# EAGLE schematic PCB - BOARD (EAGLE 8.2.0)

## Sheet 1 of 9
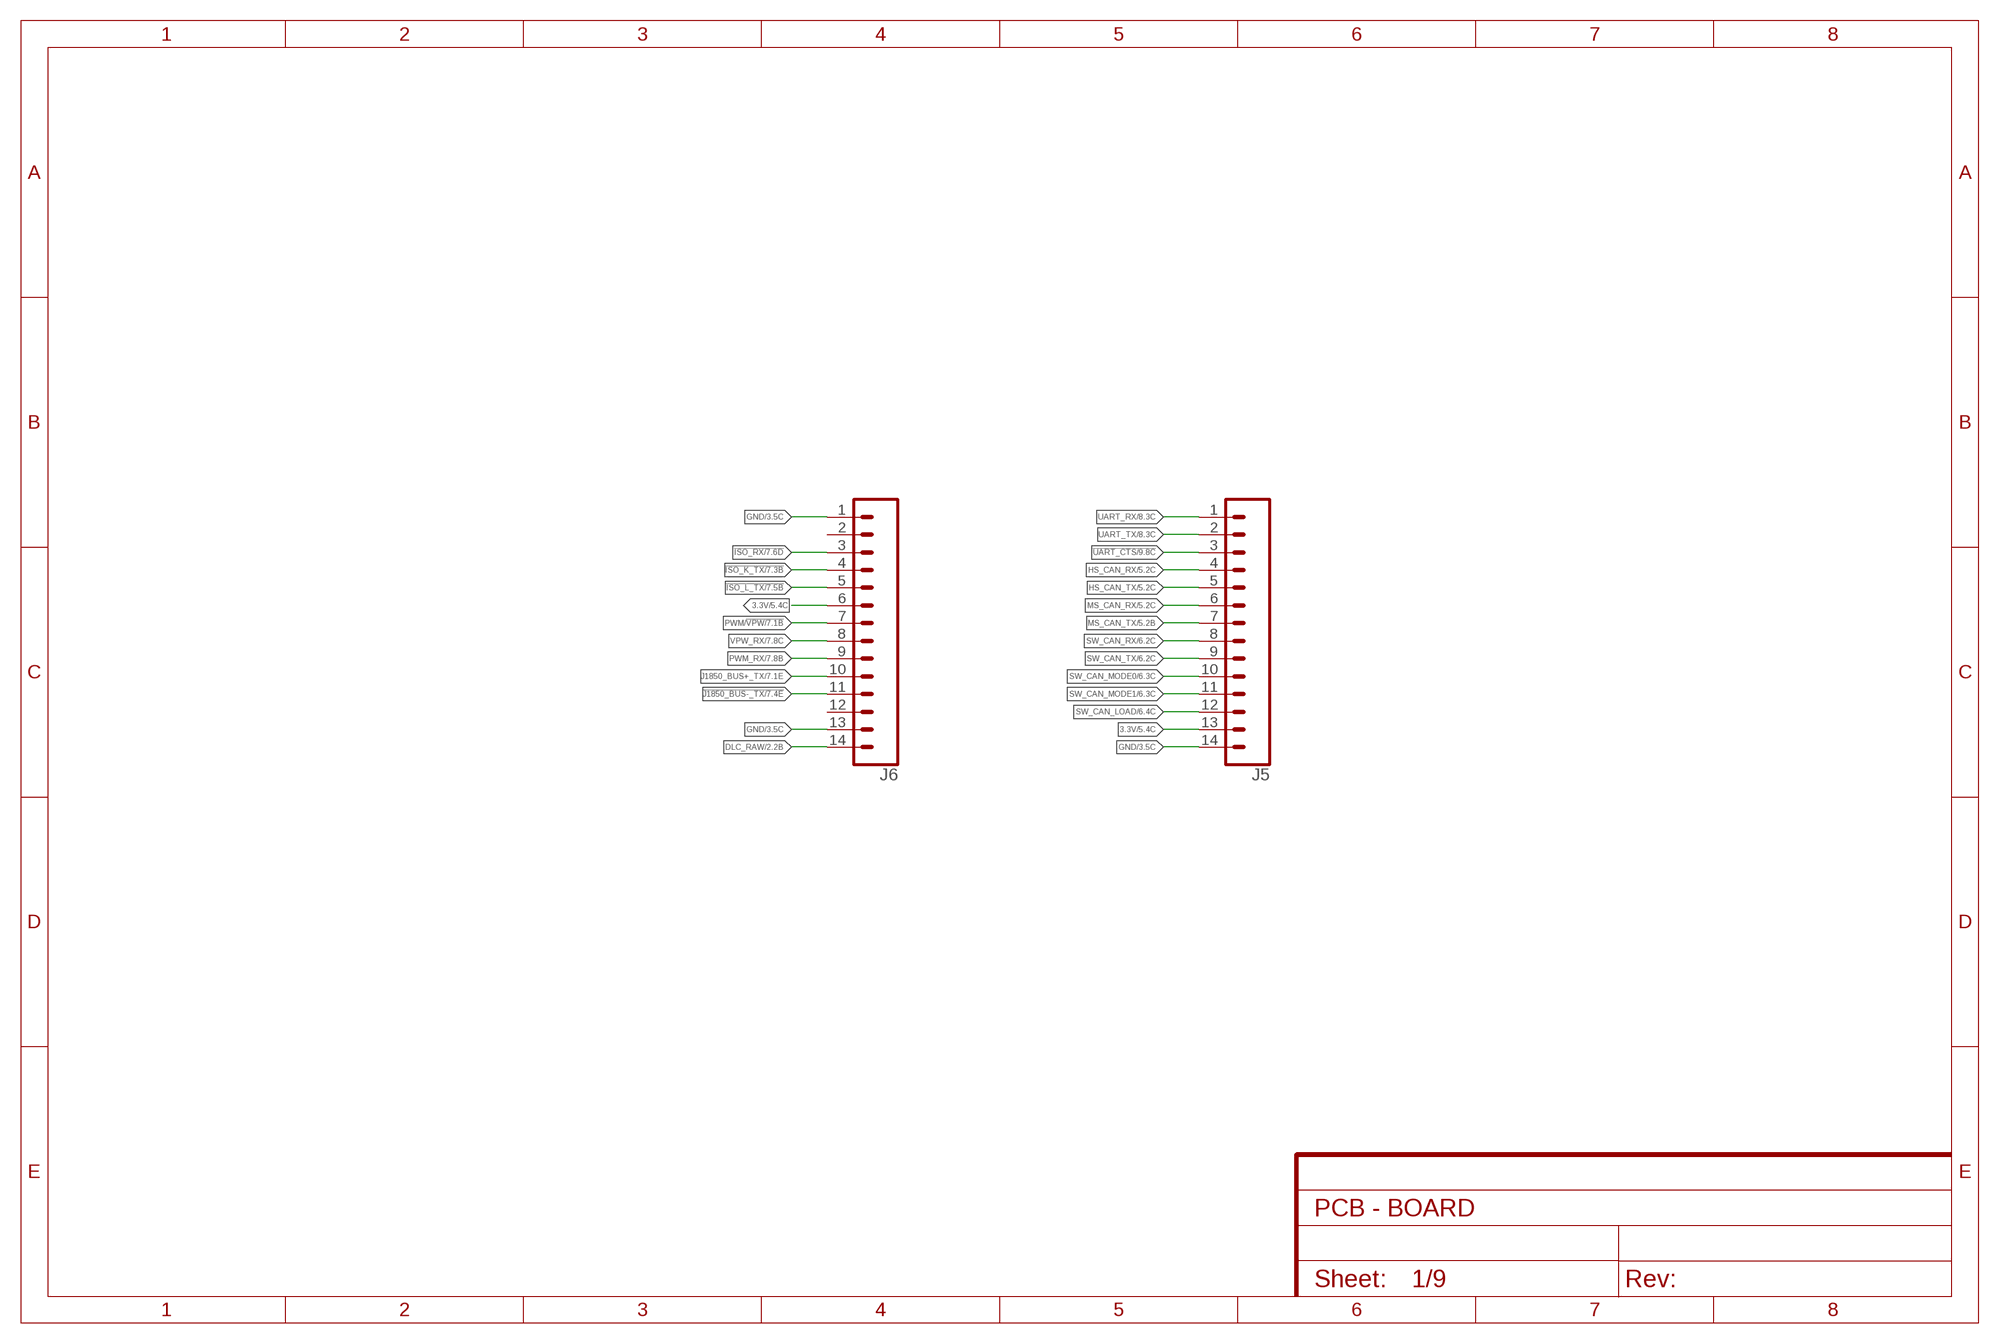
[diagram p0: schematic, sheet 1]

### Parts
J5  CONN_14  [1X14]
J6  CONN_14  [1X14]

### Nets
3.3V: J5.13 J6.6 ; also sheet 2,4,5,6,7,8
!ISO_K_TX: J6.4 ; also sheet 7
!ISO_L_TX: J6.5 ; also sheet 7
!ISO_RX: J6.3 ; also sheet 7
!J1850_BUS-_TX: J6.11 ; also sheet 7
!UART_CTS: J5.3 ; also sheet 9
DLC_RAW: J6.14 ; also sheet 2,3
GND: J5.14 J6.1 J6.13 ; also sheet 2,3,4,5,6,7,8,9
HS_CAN_RX: J5.4 ; also sheet 5
HS_CAN_TX: J5.5 ; also sheet 5
J1850_BUS+_TX: J6.10 ; also sheet 7
MS_CAN_RX: J5.6 ; also sheet 5
MS_CAN_TX: J5.7 ; also sheet 5
PWM/!VPW: J6.7 ; also sheet 7
PWM_RX: J6.9 ; also sheet 7
SW_CAN_LOAD: J5.12 ; also sheet 6
SW_CAN_MODE0: J5.10 ; also sheet 6
SW_CAN_MODE1: J5.11 ; also sheet 6
SW_CAN_RX: J5.8 ; also sheet 6
SW_CAN_TX: J5.9 ; also sheet 6
UART_RX: J5.1 ; also sheet 8,9
UART_TX: J5.2 ; also sheet 8,9
VPW_RX: J6.8 ; also sheet 7
Unconnected: J6.2 J6.12

## Sheet 2 of 9: POWER SUPPLIES
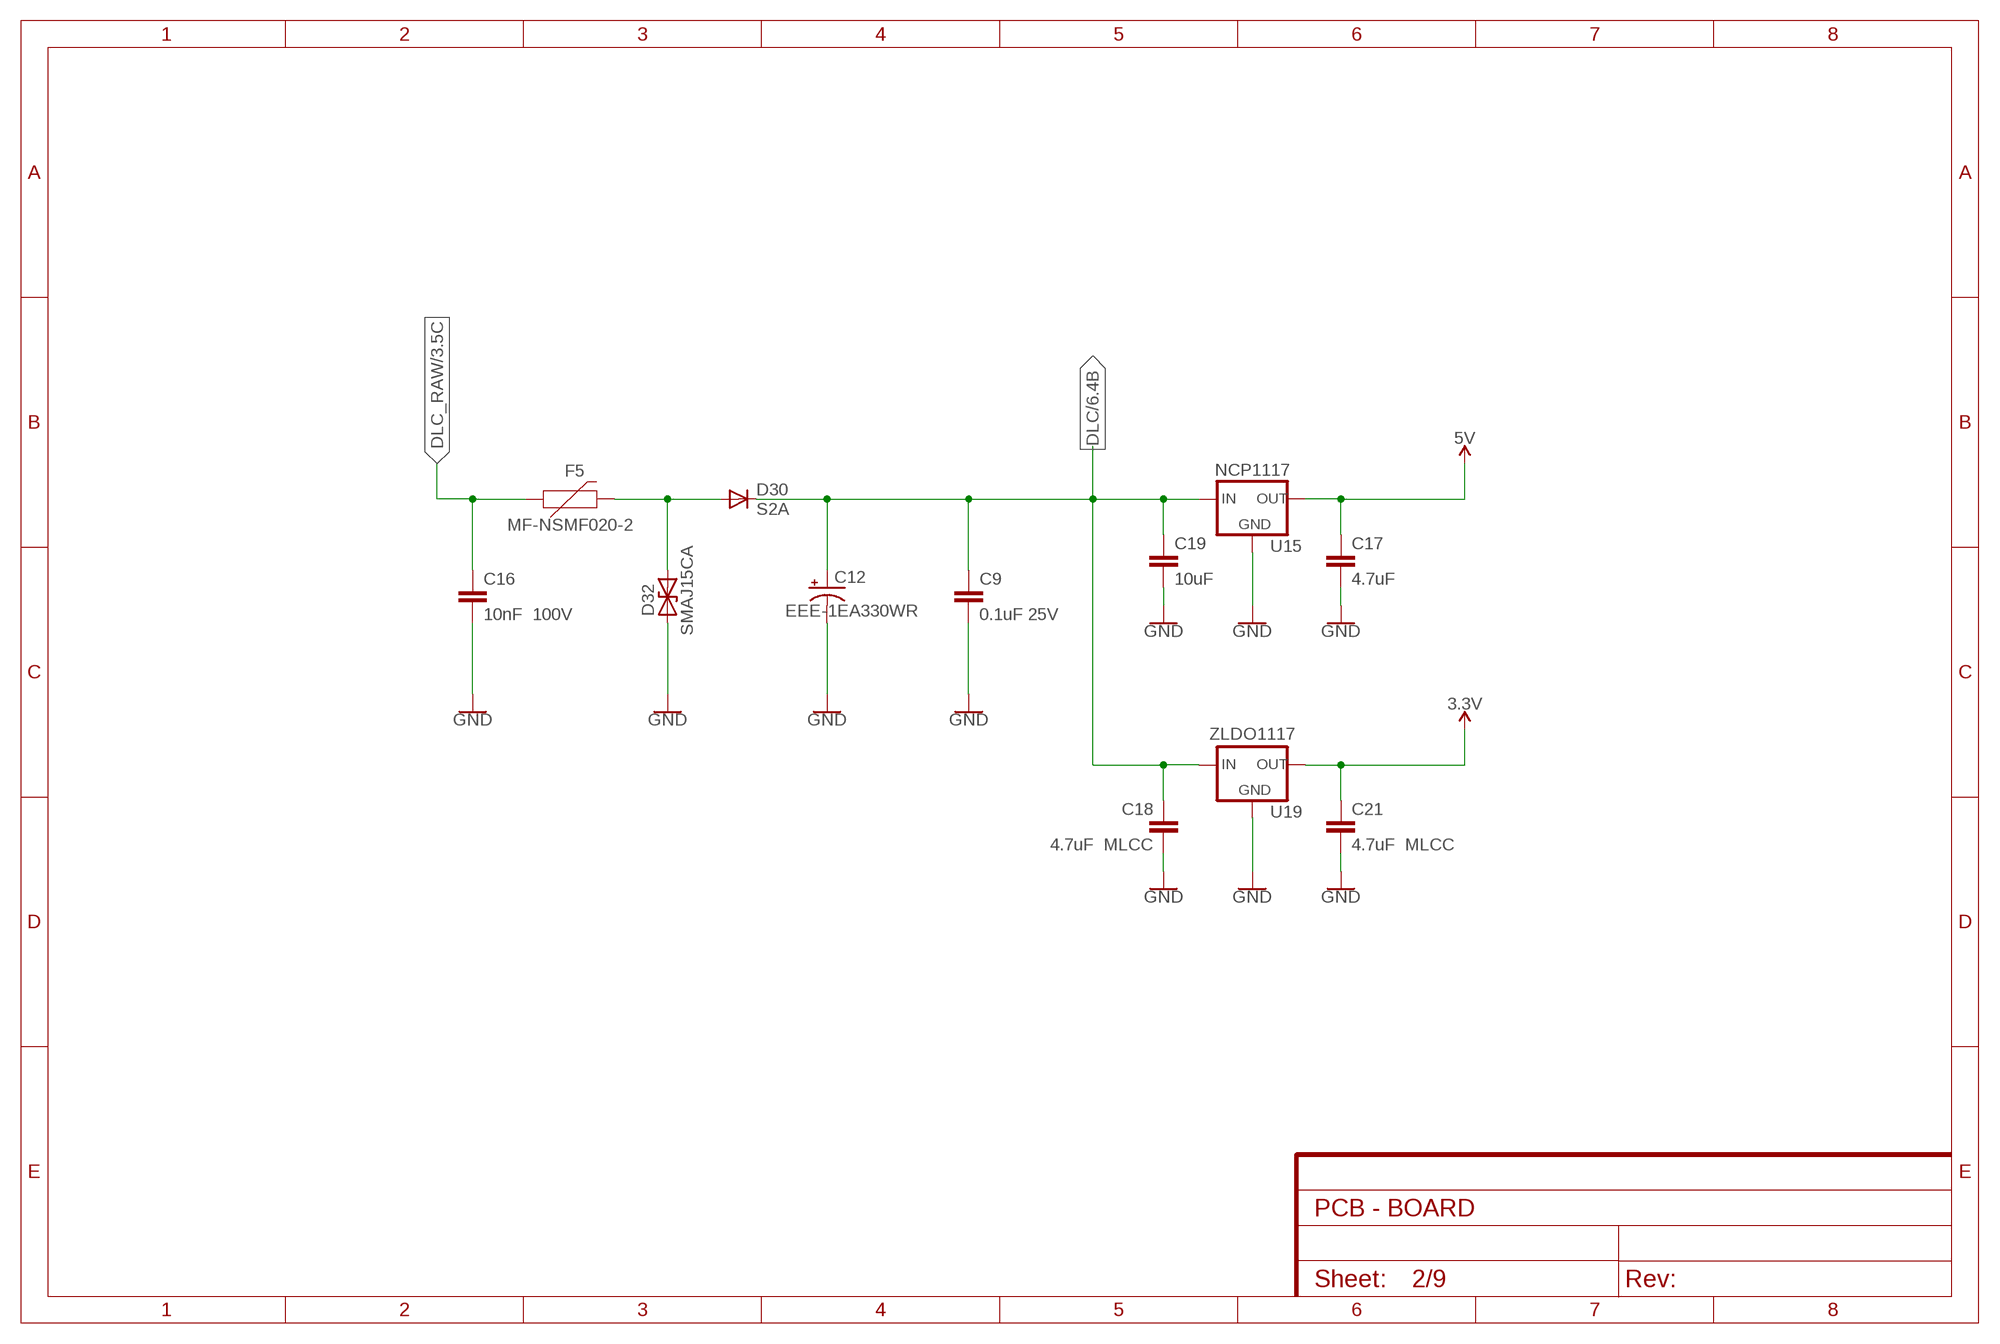
[diagram p1: schematic, sheet 2]

### Parts
C9  0.1uF 25V  1.0UF-0805-25V-(+80/-20%)  [0805]
C12  EEE-1EA330WR  [PANASONIC-C]
C16  10nF 100V  1.0UF-0805-25V-(+80/-20%)  [0805]
C17  4.7uF  1.0UF-0805-25V-(+80/-20%)  [0805]
C18  4.7uF MLCC  1.0UF-0805-25V-(+80/-20%)  [0805]
C19  10uF  1.0UF-0805-25V-(+80/-20%)  [0805]
C21  4.7uF MLCC  1.0UF-0805-25V-(+80/-20%)  [0805]
D30  S2A  [DO214AA]
D32  SMAJ15CA  [DO214AC]
F5  MF-NSMF020-2  PPTC_THREE-QUARTER-AMP  [1206]
U15  NCP1117  NCP1117DPAK  [TO-252]
U19  ZLDO1117  ZLODO1117SOT223  [SOT223]

### Nets
3.3V: C21.1 U19.2(OUT) U19.4(OUT) ; also sheet 1,4,5,6,7,8
5V: C17.1 U15.2(OUT) ; also sheet 4,5,7
DLC: C9.1 C12.2(+) C18.1 C19.1 D30.C U15.3(IN) U19.3(IN) ; also sheet 4,6,7
DLC_RAW: C16.1 F5.1 ; also sheet 1,3
DLC_RAW2: D30.A D32.C F5.2
GND: C9.2 C12.1(-) C16.2 C17.2 C18.2 C19.2 C21.2 D32.A U15.1(GND) U19.1(GND) ; also sheet 1,3,4,5,6,7,8,9

## Sheet 3 of 9: PCB and OBD connector
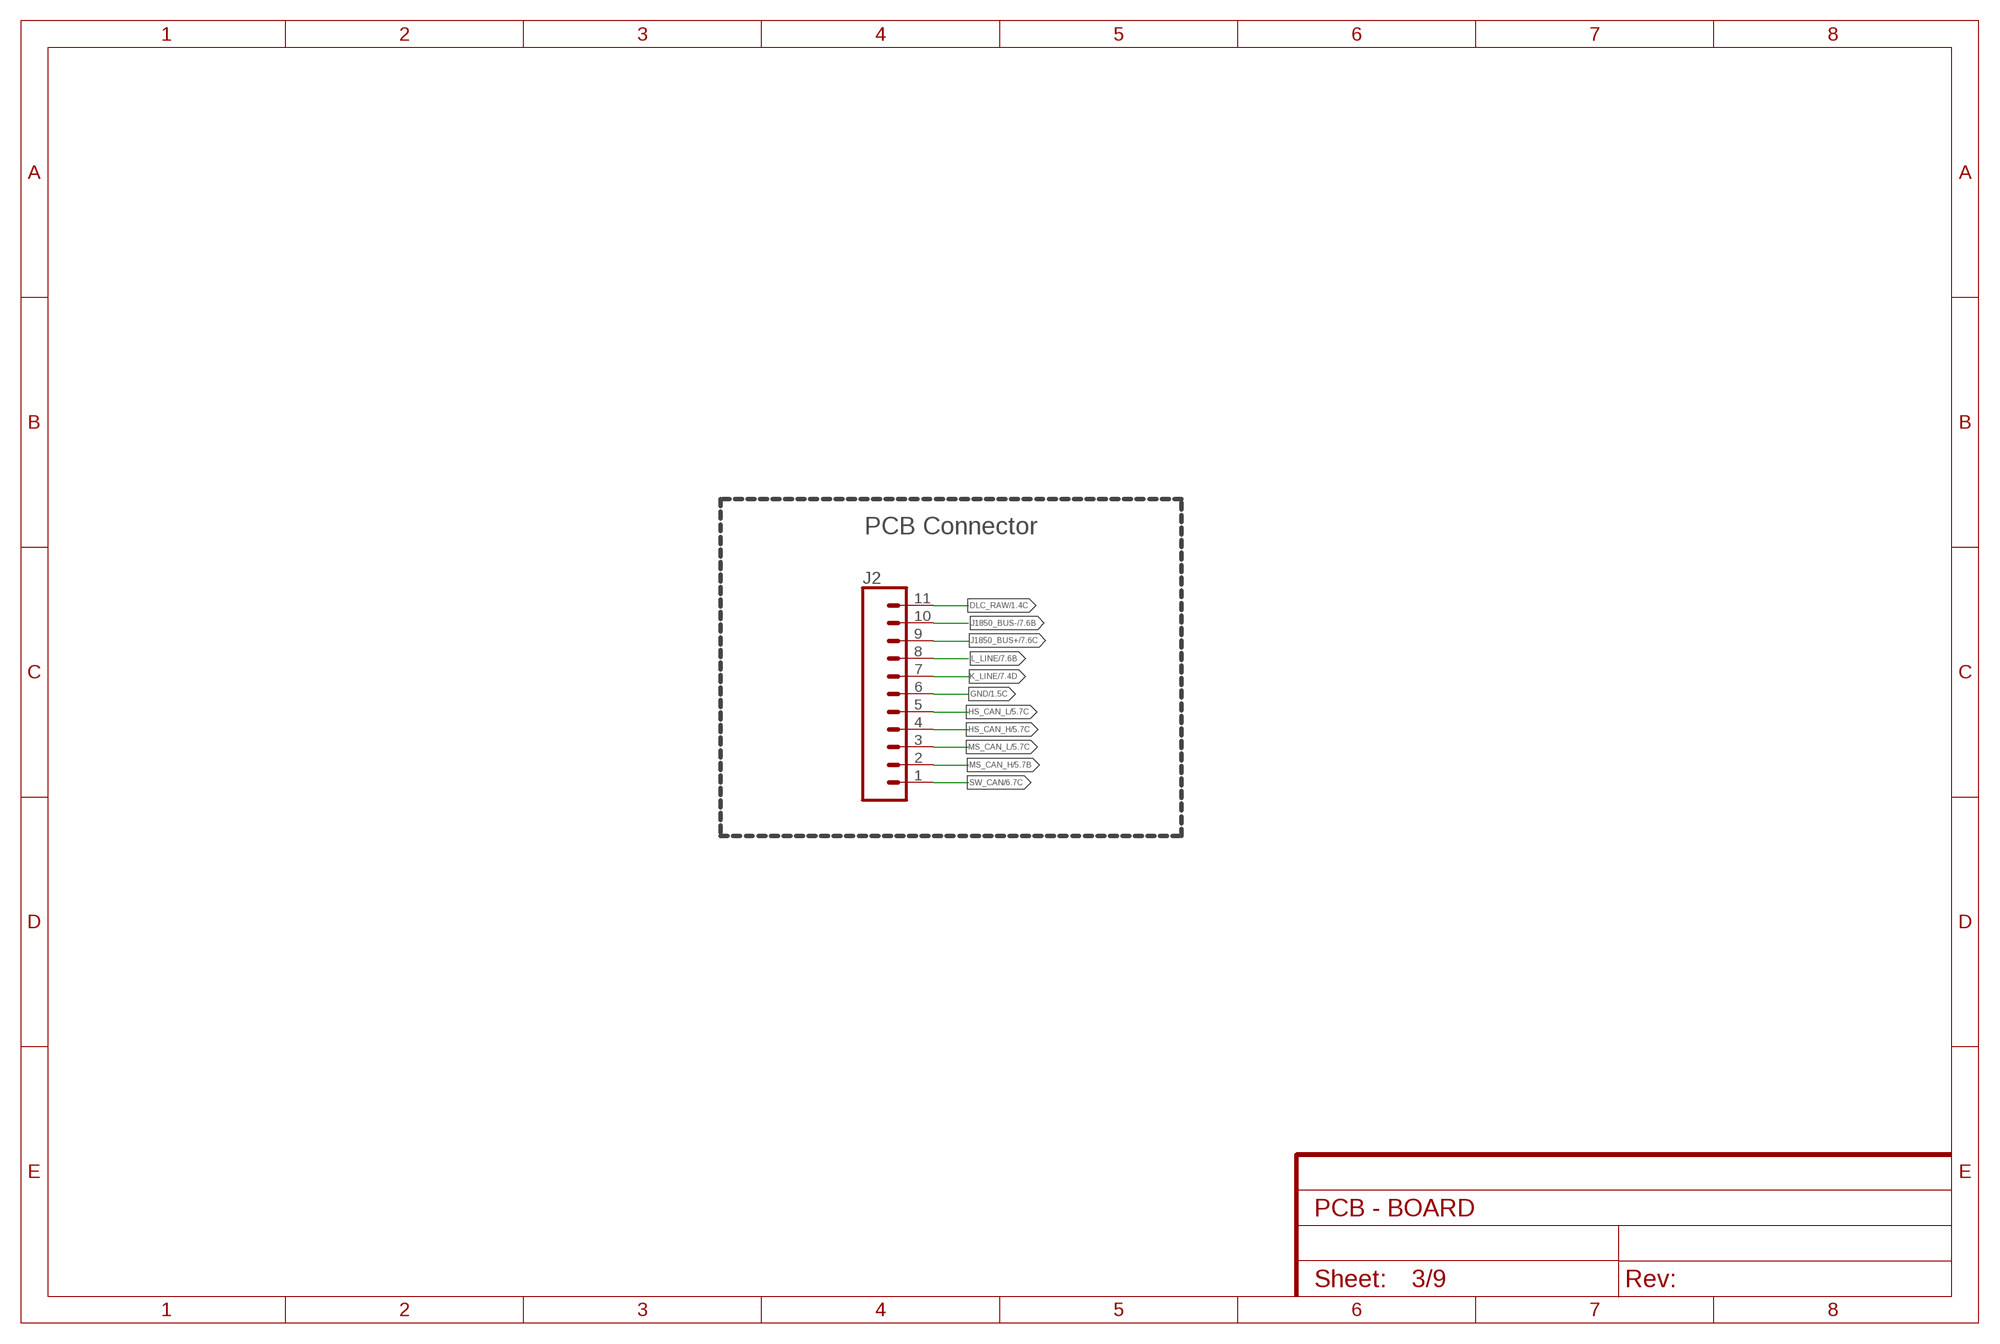
[diagram p2: schematic, sheet 3]

### Parts
J2  CONN_11  [1X11]

### Nets
DLC_RAW: J2.11 ; also sheet 1,2
GND: J2.6 ; also sheet 1,2,4,5,6,7,8,9
HS_CAN_H: J2.4 ; also sheet 5
HS_CAN_L: J2.5 ; also sheet 5
J1850_BUS+: J2.9 ; also sheet 7
J1850_BUS-: J2.10 ; also sheet 7
K_LINE: J2.7 ; also sheet 7
L_LINE: J2.8 ; also sheet 7
MS_CAN_H: J2.2 ; also sheet 5
MS_CAN_L: J2.3 ; also sheet 5
SW_CAN: J2.1 ; also sheet 6

### Notes on the sheet
- PCB Connector

## Sheet 4 of 9: LED's
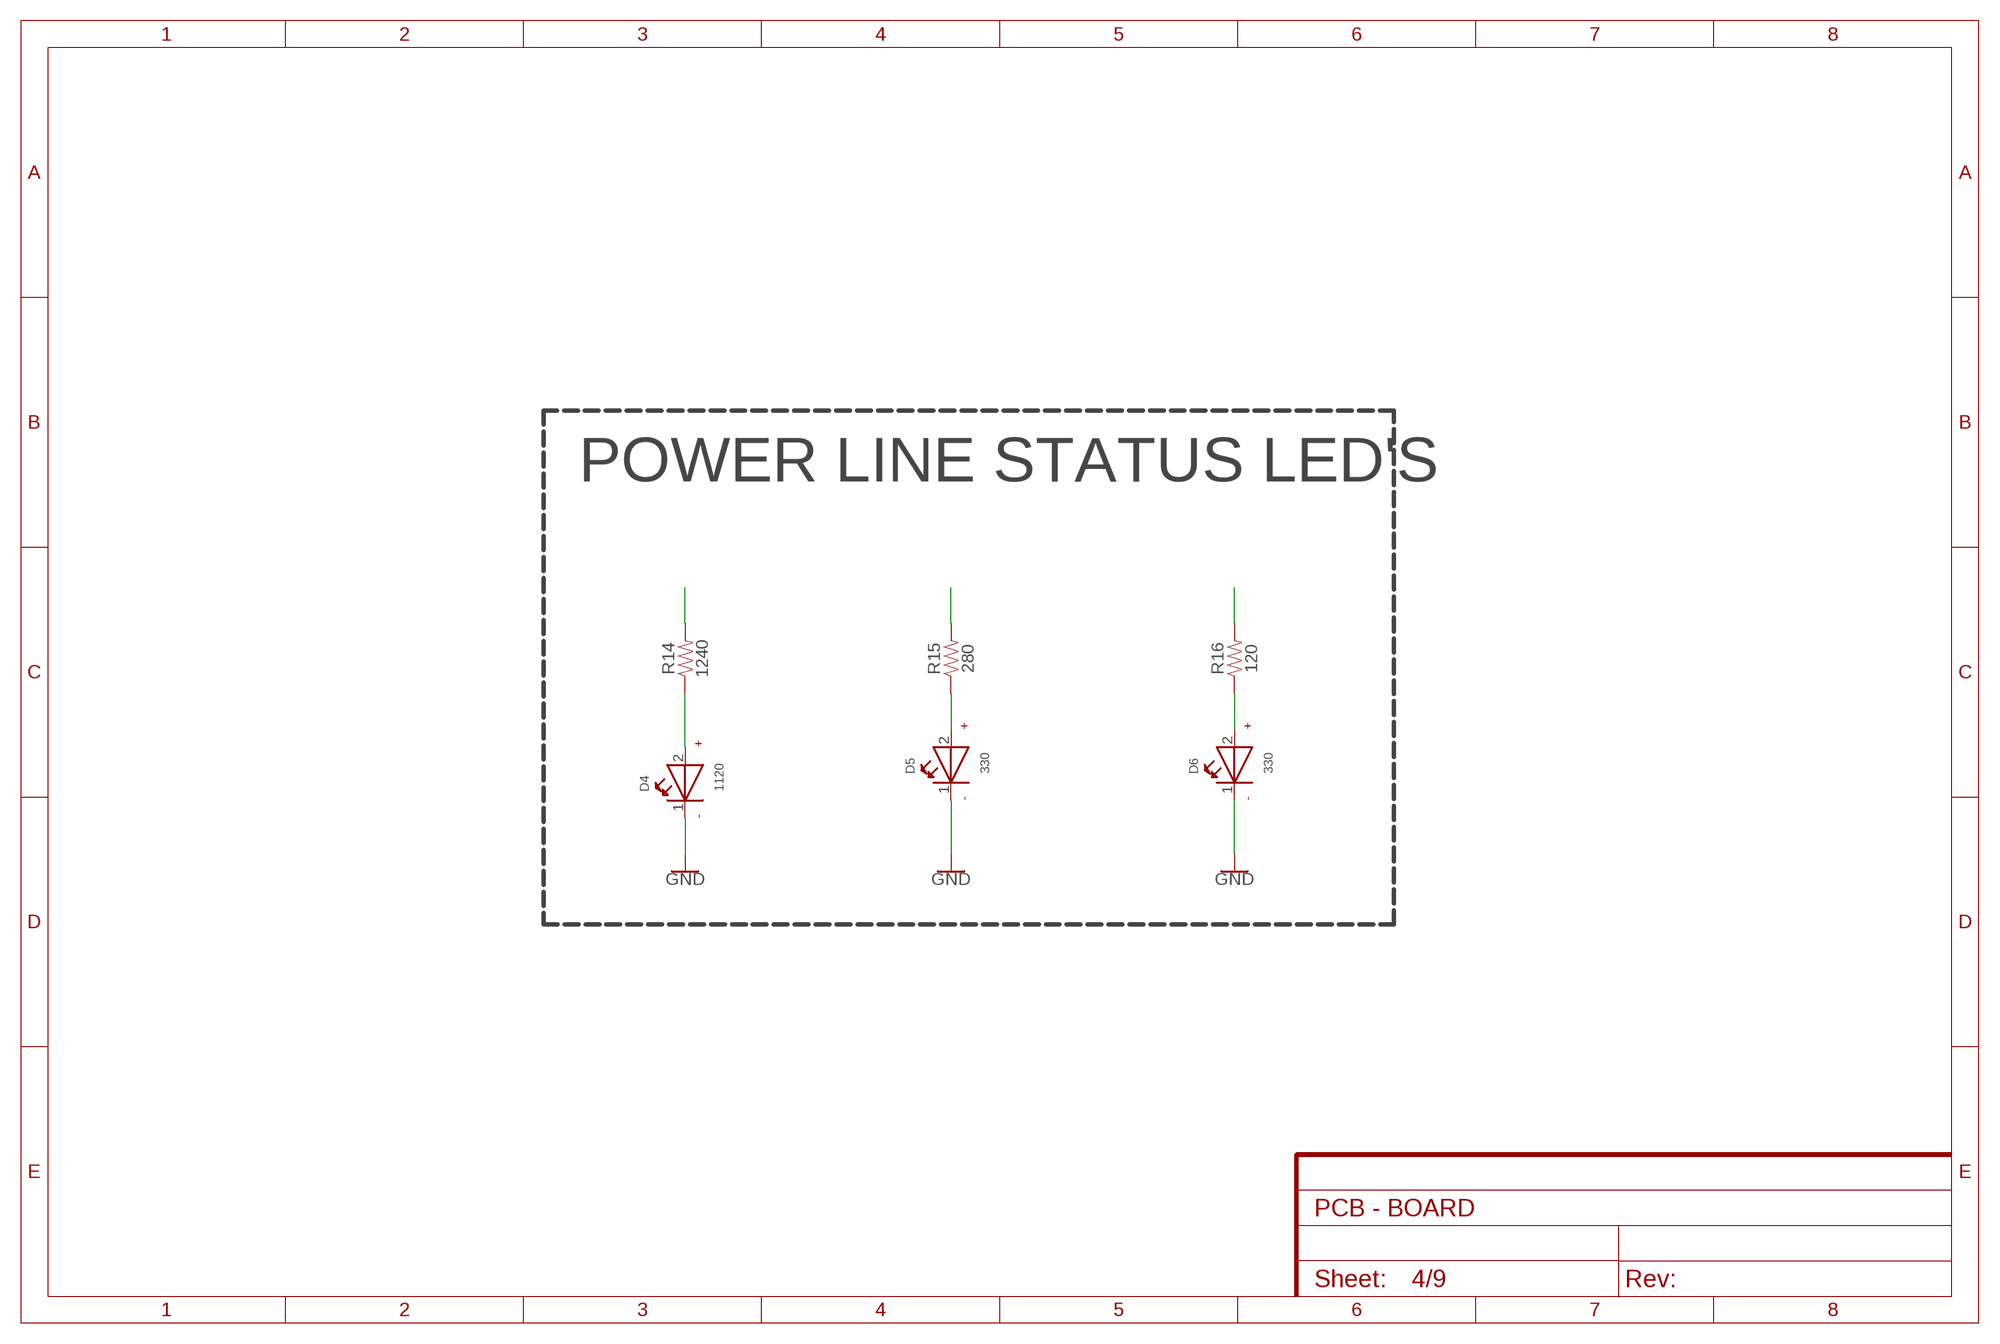
[diagram p3: schematic, sheet 4]

### Parts
D4  1120  WL-SMCW-150120BS75000-B  [WL-SMCW_1206]
D5  330  WL-SMCW-150120BS75000-B  [WL-SMCW_1206]
D6  330  WL-SMCW-150120BS75000-B  [WL-SMCW_1206]
R14  1240  0.3OHM-0805-1/8W-1%  [0805]
R15  280  0.3OHM-0805-1/8W-1%  [0805]
R16  120  0.3OHM-0805-1/8W-1%  [0805]

### Nets
3.3V: R16.2 ; also sheet 1,2,5,6,7,8
5V: R15.2 ; also sheet 2,5,7
DLC: R14.2 ; also sheet 2,6,7
GND: D4.1(-) D5.1(-) D6.1(-) ; also sheet 1,2,3,5,6,7,8,9
N$29: D6.2(+) R16.1
N$30: D5.2(+) R15.1
N$32: D4.2(+) R14.1

### Notes on the sheet
- POWER LINE STATUS LED'S

## Sheet 5 of 9: CAN TRANSCEIVER - TJA1048
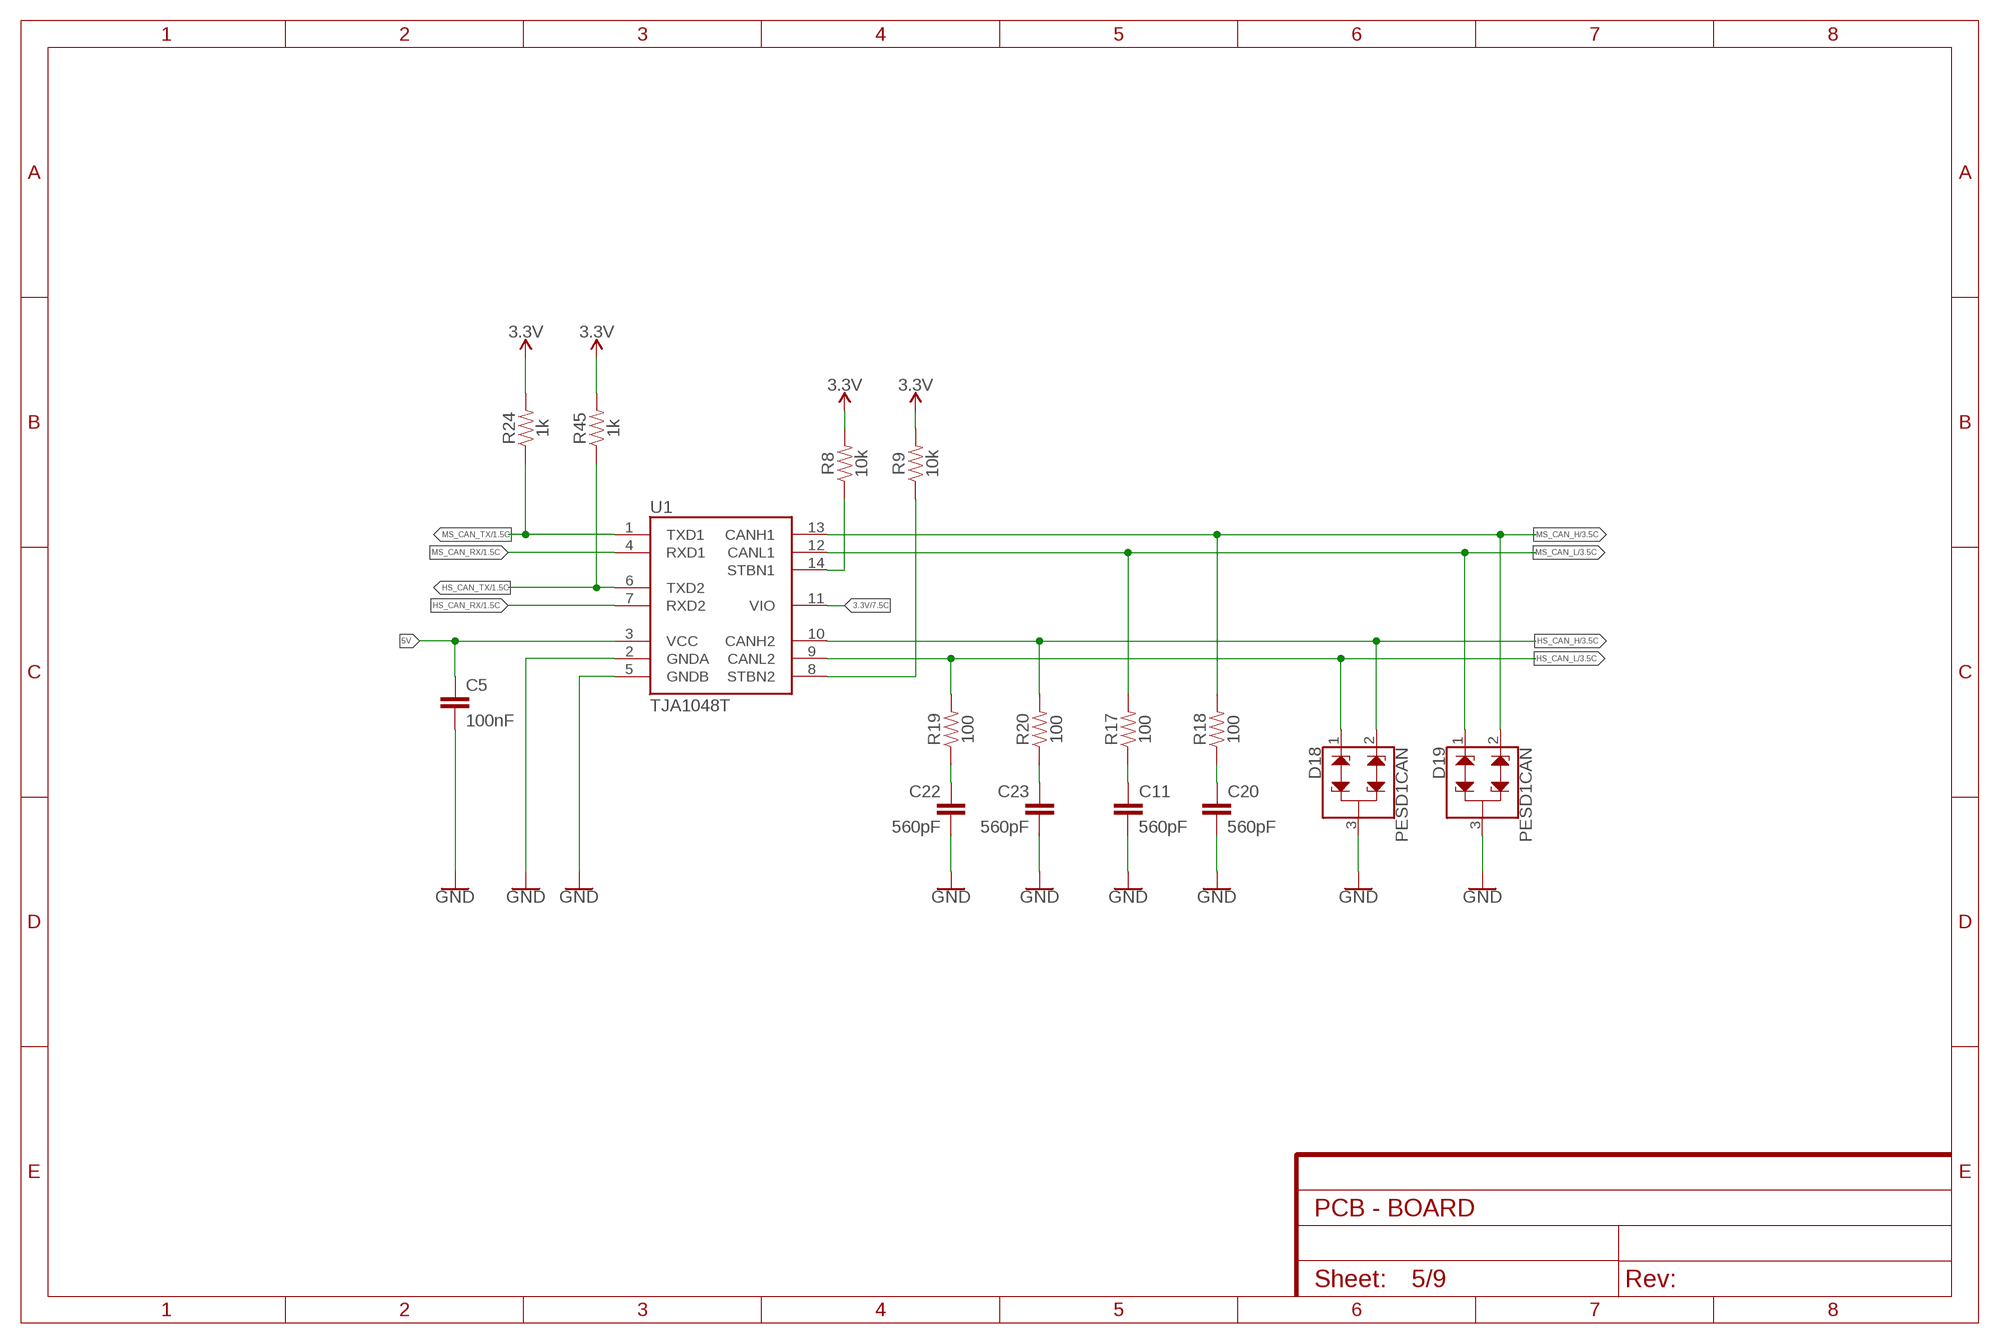
[diagram p4: schematic, sheet 5]

### Parts
C5  100nF  1.0UF-0805-25V-(+80/-20%)  [0805]
C11  560pF  1.0UF-0805-25V-(+80/-20%)  [0805]
C20  560pF  1.0UF-0805-25V-(+80/-20%)  [0805]
C22  560pF  1.0UF-0805-25V-(+80/-20%)  [0805]
C23  560pF  1.0UF-0805-25V-(+80/-20%)  [0805]
D18  PESD1CAN  [SOT23-3]
D19  PESD1CAN  [SOT23-3]
R8  10k  0.3OHM-0805-1/8W-1%  [0805]
R9  10k  0.3OHM-0805-1/8W-1%  [0805]
R17  100  0.3OHM-0805-1/8W-1%  [0805]
R18  100  0.3OHM-0805-1/8W-1%  [0805]
R19  100  0.3OHM-0805-1/8W-1%  [0805]
R20  100  0.3OHM-0805-1/8W-1%  [0805]
R24  1k  0.3OHM-0805-1/8W-1%  [0805]
R45  1k  0.3OHM-0805-1/8W-1%  [0805]
U1  TJA1048T  [SO14]

### Nets
3.3V: R8.2 R9.2 R24.2 R45.2 U1.11(VIO) ; also sheet 1,2,4,6,7,8
5V: C5.1 U1.3(VCC) ; also sheet 2,4,7
GND: C5.2 C11.2 C20.2 C22.2 C23.2 D18.3 D19.3 U1.2(GNDA) U1.5(GNDB) ; also sheet 1,2,3,4,6,7,8,9
HS_CAN_H: D18.2 R20.2 U1.10(CANH2) ; also sheet 3
HS_CAN_L: D18.1 R19.2 U1.9(CANL2) ; also sheet 3
HS_CAN_RX: U1.7(RXD2) ; also sheet 1
HS_CAN_TX: R45.1 U1.6(TXD2) ; also sheet 1
MS_CAN_H: D19.2 R18.2 U1.13(CANH1) ; also sheet 3
MS_CAN_L: D19.1 R17.2 U1.12(CANL1) ; also sheet 3
MS_CAN_RX: U1.4(RXD1) ; also sheet 1
MS_CAN_TX: R24.1 U1.1(TXD1) ; also sheet 1
N$17: C11.1 R17.1
N$25: C20.1 R18.1
N$26: C22.1 R19.1
N$27: C23.1 R20.1
STBN_1: R8.1 U1.14(STBN1)
STBN_2: R9.1 U1.8(STBN2)

## Sheet 6 of 9: Single Wire CAN Transceiver
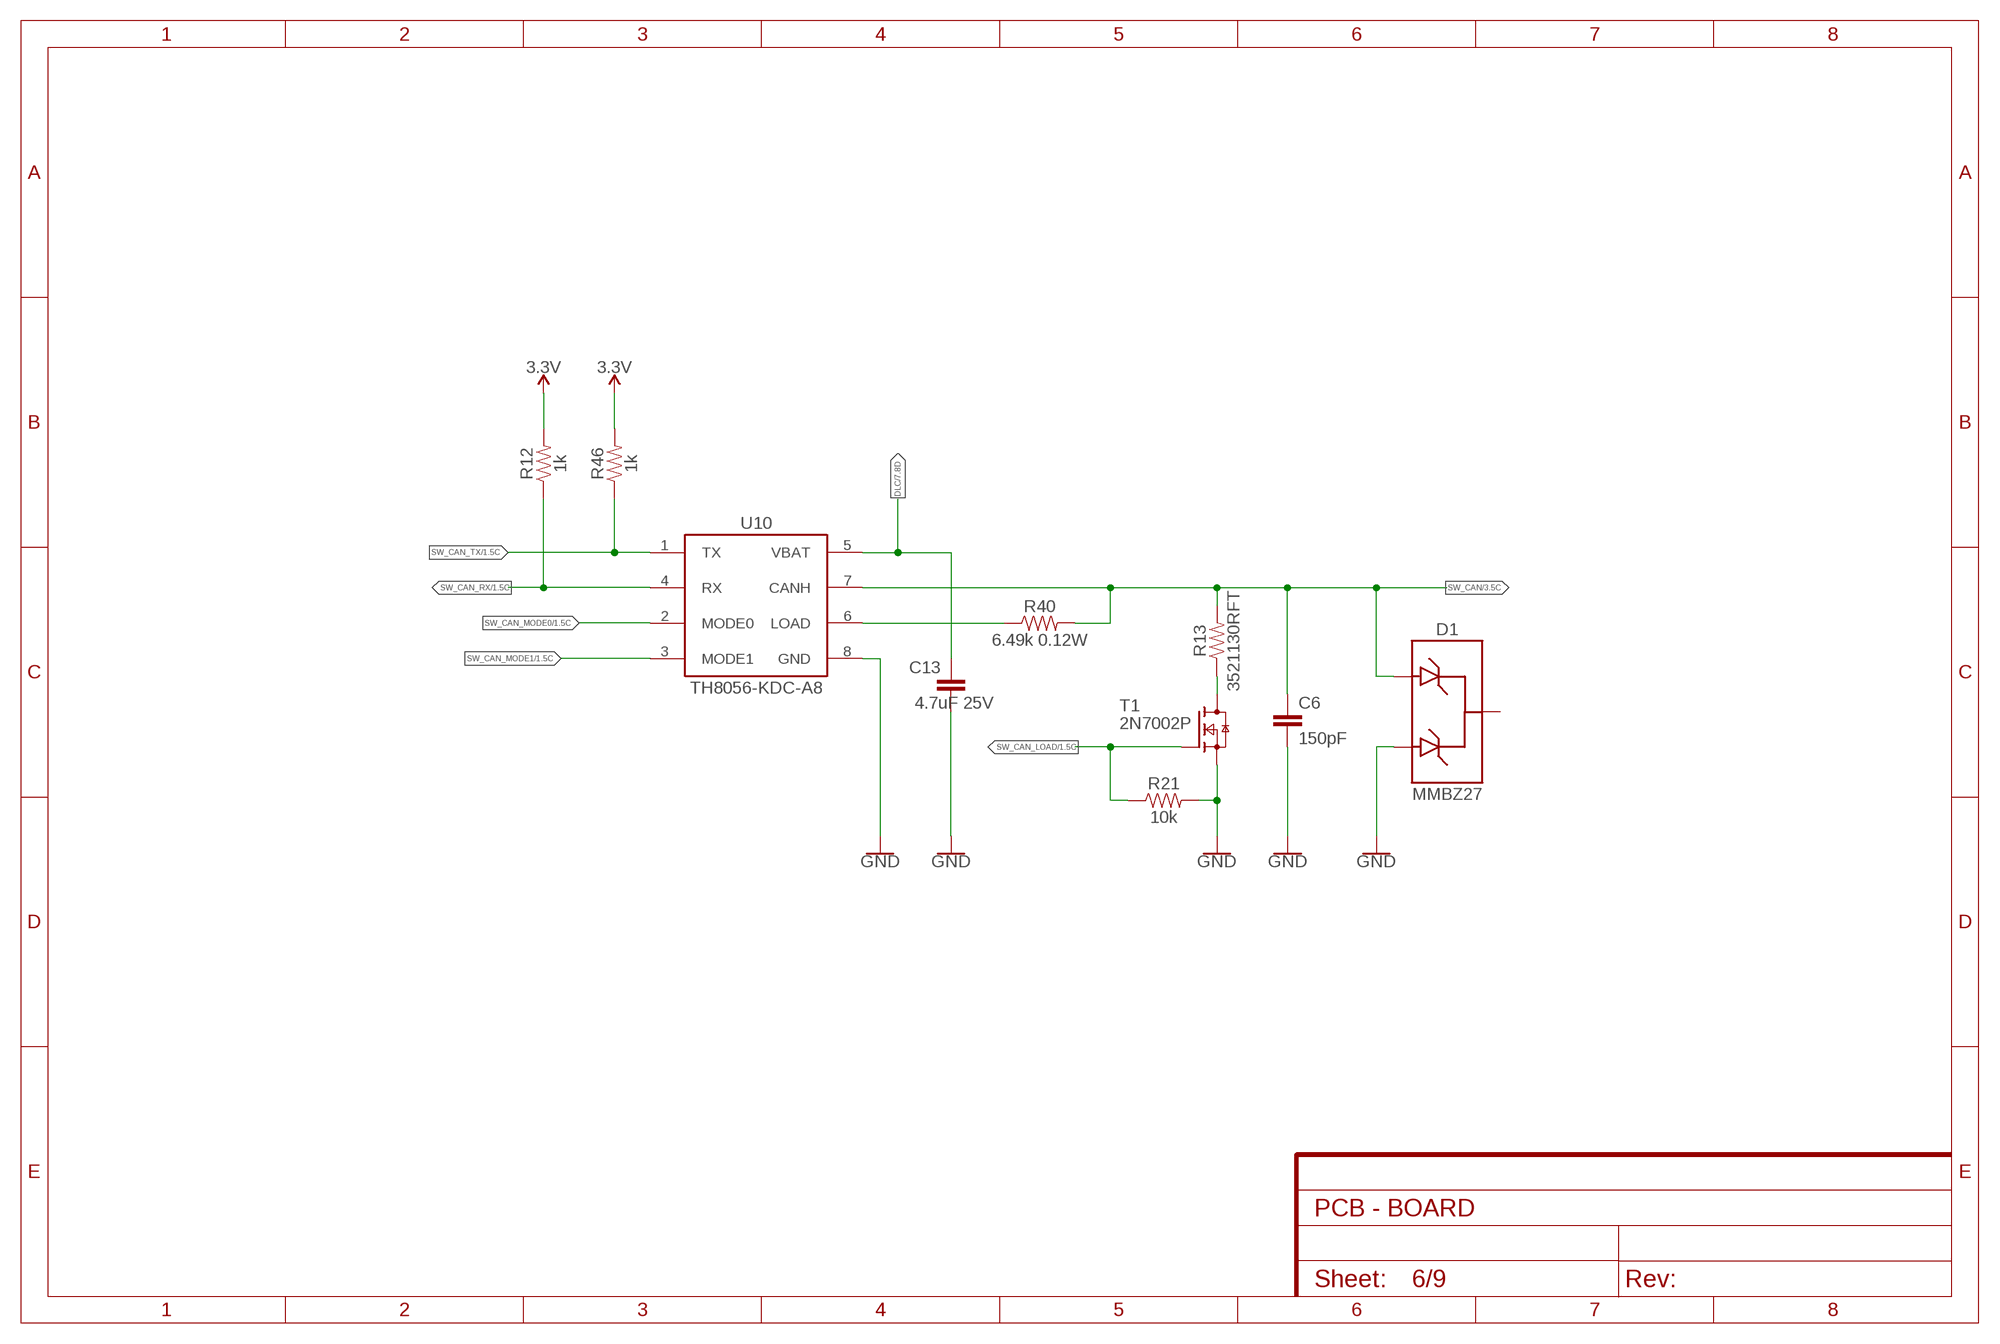
[diagram p5: schematic, sheet 6]

### Parts
C6  150pF  1.0UF-0805-25V-(+80/-20%)  [0805]
C13  4.7uF 25V  1.0UF-0805-25V-(+80/-20%)  [0805]
D1  MMBZ27  [SOT23-3]
R12  1k  0.3OHM-0805-1/8W-1%  [0805]
R13  3521130RFT  [3521]
R21  10k  0.3OHM-0805-1/8W-1%  [0805]
R40  6.49k 0.12W  10OHM-1206-1/4W-1%  [1206]
R46  1k  0.3OHM-0805-1/8W-1%  [0805]
T1  2N7002P  [SOT23]
U10  TH8056-KDC-A8  [SOIC-8]

### Nets
3.3V: R12.2 R46.2 ; also sheet 1,2,4,5,7,8
DLC: C13.1 U10.5(VBAT) ; also sheet 2,4,7
GND: C6.2 C13.2 D1.2(A2) R21.2 T1.2(S) U10.8(GND) ; also sheet 1,2,3,4,5,7,8,9
LOAD: R40.1 U10.6(LOAD)
N$13: R13.1 T1.3(D)
SW_CAN: C6.1 D1.1(A1) R13.2 R40.2 U10.7(CANH) ; also sheet 3
SW_CAN_LOAD: R21.1 T1.1(G) ; also sheet 1
SW_CAN_MODE0: U10.2(MODE0) ; also sheet 1
SW_CAN_MODE1: U10.3(MODE1) ; also sheet 1
SW_CAN_RX: R12.1 U10.4(RX) ; also sheet 1
SW_CAN_TX: R46.1 U10.1(TX) ; also sheet 1
Unconnected: D1.3(C)

## Sheet 7 of 9: ISO 9141/ISO 14230 AND J1850 Transceiver
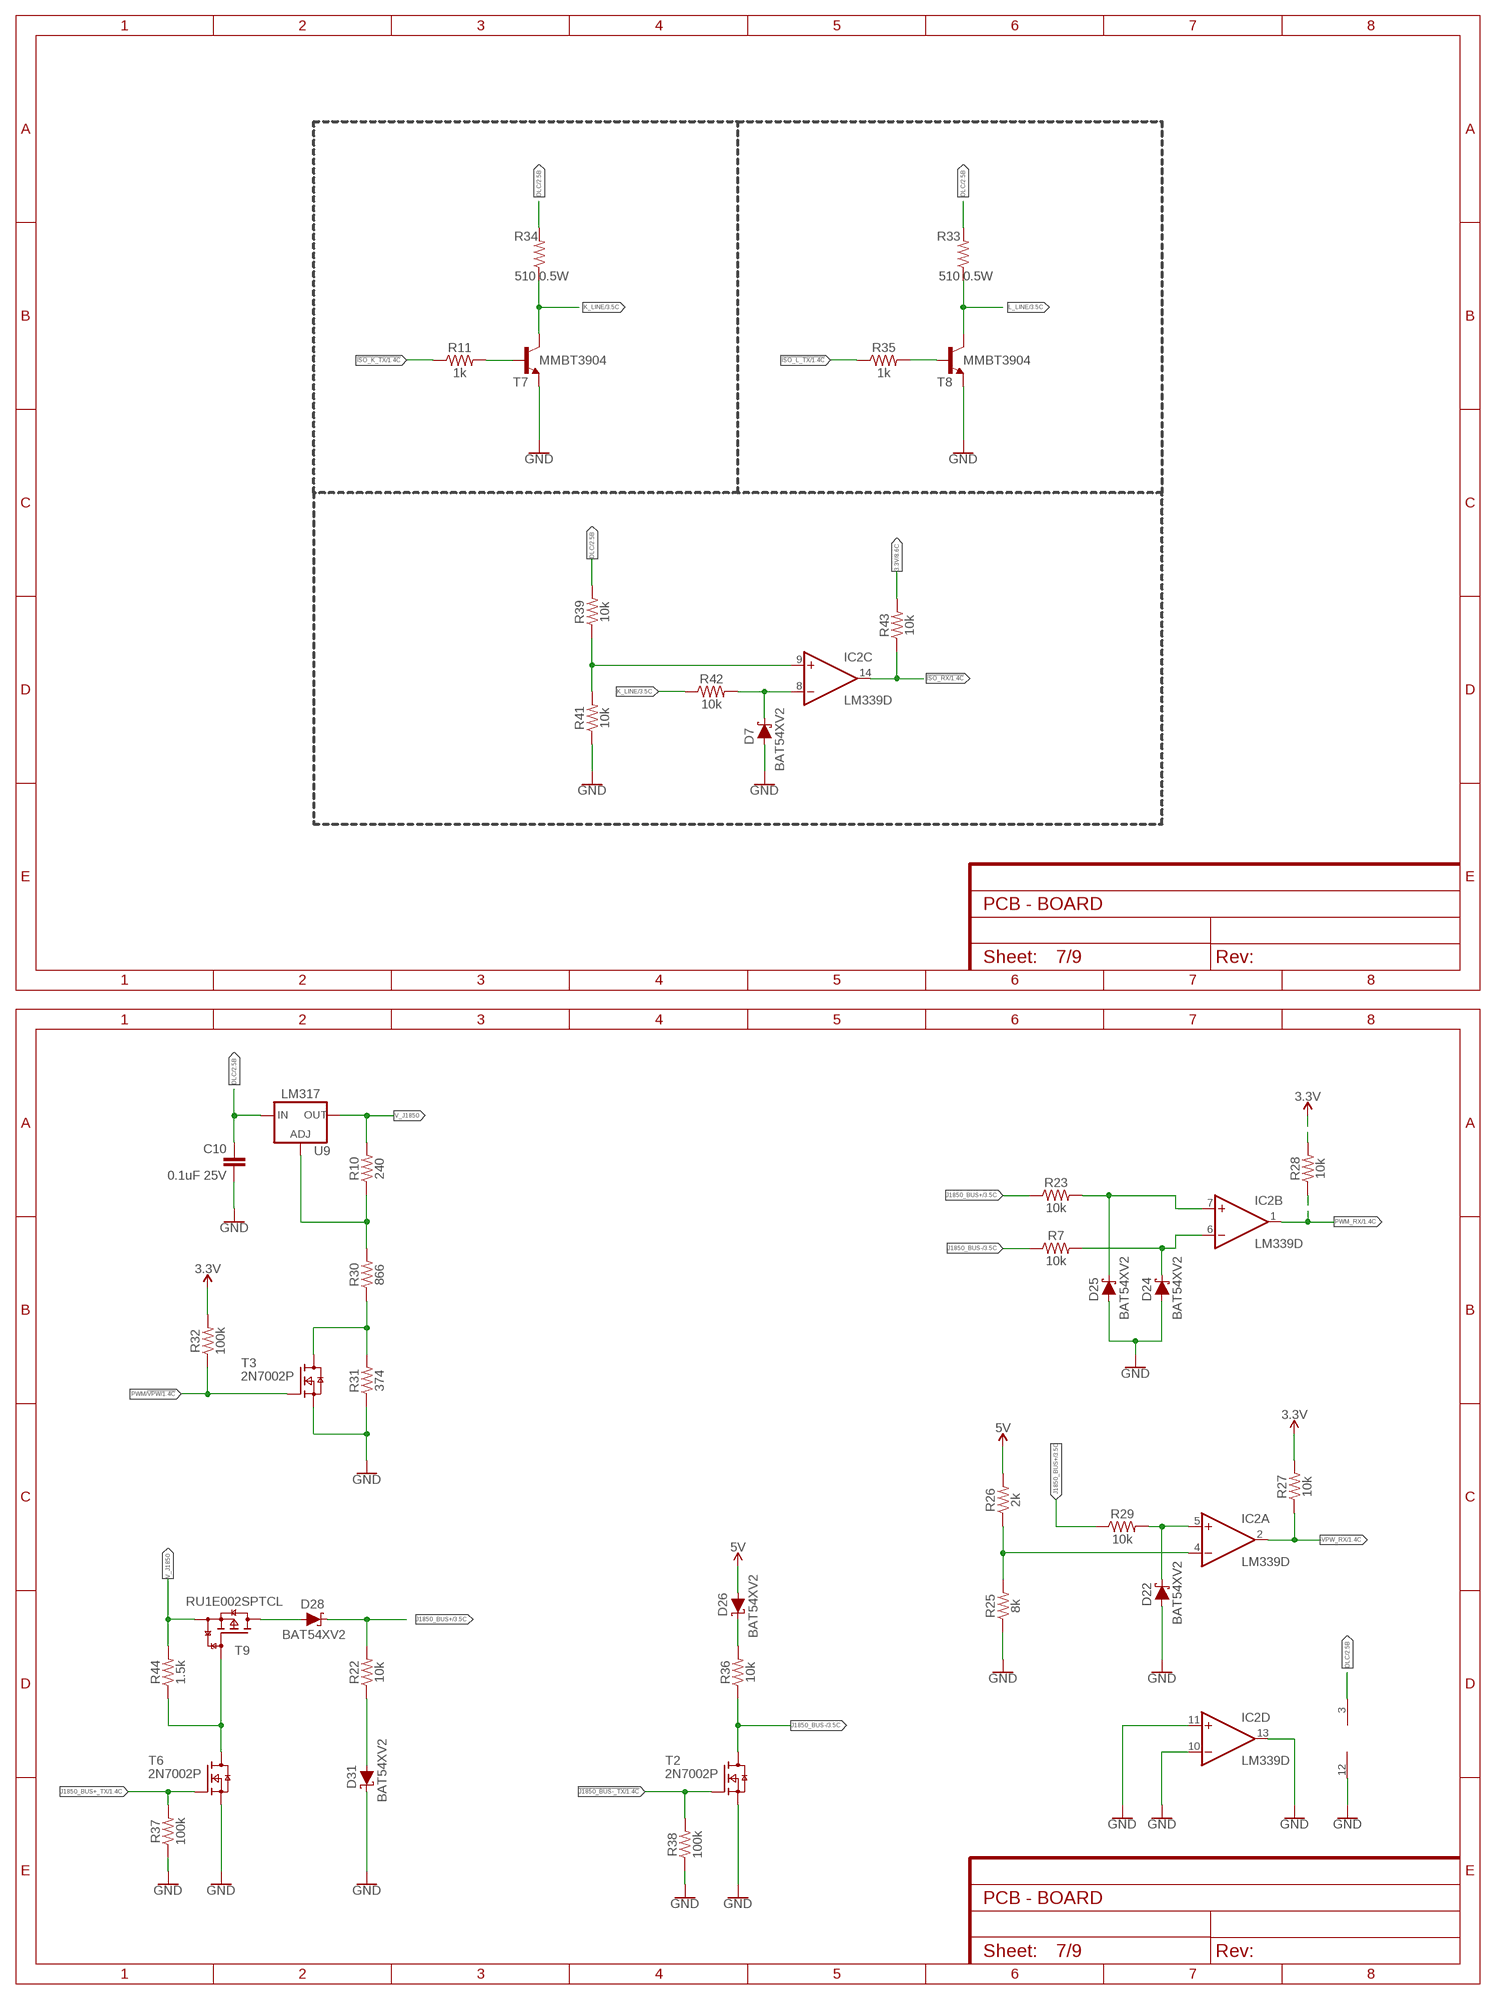
[diagram p6: schematic, sheet 7]

### Parts
C10  0.1uF 25V  1.0UF-0805-25V-(+80/-20%)  [0805]
D7  BAT54XV2  [SOD-523F]
D22  BAT54XV2  [SOD-523F]
D24  BAT54XV2  [SOD-523F]
D25  BAT54XV2  [SOD-523F]
D26  BAT54XV2  [SOD-523F]
D28  BAT54XV2  [SOD-523F]
D31  BAT54XV2  [SOD-523F]
IC2  LM339D  [SO14]
R7  10k  0.3OHM-0805-1/8W-1%  [0805]
R10  240  0.3OHM-0805-1/8W-1%  [0805]
R11  1k  0.3OHM-0805-1/8W-1%  [0805]
R22  10k  0.3OHM-0805-1/8W-1%  [0805]
R23  10k  0.3OHM-0805-1/8W-1%  [0805]
R25  8k  0.3OHM-0805-1/8W-1%  [0805]
R26  2k  0.3OHM-0805-1/8W-1%  [0805]
R27  10k  0.3OHM-0805-1/8W-1%  [0805]
R28  10k  0.3OHM-0805-1/8W-1%  [0805]
R29  10k  0.3OHM-0805-1/8W-1%  [0805]
R30  866  0.3OHM-0805-1/8W-1%  [0805]
R31  374  0.3OHM-0805-1/8W-1%  [0805]
R32  100k  0.3OHM-0805-1/8W-1%  [0805]
R33  510 0.5W  0.1OHM-1210-1/2W-1%  [1210]
R34  510 0.5W  0.1OHM-1210-1/2W-1%  [1210]
R35  1k  0.3OHM-0805-1/8W-1%  [0805]
R36  10k  0.3OHM-0805-1/8W-1%  [0805]
R37  100k  0.3OHM-0805-1/8W-1%  [0805]
R38  100k  0.3OHM-0805-1/8W-1%  [0805]
R39  10k  0.3OHM-0805-1/8W-1%  [0805]
R41  10k  0.3OHM-0805-1/8W-1%  [0805]
R42  10k  0.3OHM-0805-1/8W-1%  [0805]
R43  10k  0.3OHM-0805-1/8W-1%  [0805]
R44  1.5k  0.3OHM-0805-1/8W-1%  [0805]
T2  2N7002P  [SOT23]
T3  2N7002P  [SOT23]
T6  2N7002P  [SOT23]
T7  MMBT3904  MMBT3904LT1-NPN-SOT23-BEC  [SOT23-BEC]
T8  MMBT3904  MMBT3904LT1-NPN-SOT23-BEC  [SOT23-BEC]
T9  RU1E002SPTCL  BSS84AKW  [SOT323]
U9  LM317  V_REG_317SMD  [SOT223]

### Nets
3.3V: R27.2 R28.2 R32.2 R43.2 ; also sheet 1,2,4,5,6,8
5V: D26.A R26.2 ; also sheet 2,4,5
!ISO_K_TX: R11.1 ; also sheet 1
!ISO_L_TX: R35.1 ; also sheet 1
!ISO_RX: IC2.14(C:OUT) R43.1 ; also sheet 1
!J1850_BUS-_TX: R38.2 T2.1(G) ; also sheet 1
ADJ: R10.1 R30.2 U9.1(ADJ)
COMPARATOR+: D22.C IC2.5(A:+IN) R29.2
COMPARATOR-: IC2.4(A:-IN) R25.2 R26.1
DLC: C10.1 IC2.3(P:V+) R33.2 R34.2 R39.2 U9.3(IN) ; also sheet 2,4,6
GND: C10.2 D7.A D22.A D24.A D25.A D31.C IC2.10(D:-IN) IC2.11(D:+IN) IC2.12(P:GND) IC2.13(D:OUT) R25.1 R31.1 R37.1 R38.1 R41.1 T2.2(S) T3.2(S) T6.2(S) T7.E T8.E ; also sheet 1,2,3,4,5,6,8,9
J1850_BUS+: D25.C D28.C IC2.7(B:+IN) R22.2 R23.1 R23.2 R29.1 ; also sheet 3
J1850_BUS+_TX: R37.2 T6.1(G) ; also sheet 1
J1850_BUS-: D24.C IC2.6(B:-IN) R7.1 R7.2 R36.1 T2.3(D) ; also sheet 3
K-LINE: D7.C IC2.8(C:-IN) R42.2
K_LINE: R34.1 R42.1 T7.C ; also sheet 3
L_LINE: R33.1 T8.C ; also sheet 3
N$1: R44.1 T6.3(D) T9.1(G)
N$5: D26.C R36.2
N$8: IC2.9(C:+IN) R39.1 R41.2
N$9: D28.A T9.3(D)
N$11: D31.A R22.1
N$12: R35.2 T8.B
N$14: R11.2 T7.B
N$15: R30.1 R31.2 T3.3(D)
PWM/!VPW: R32.1 T3.1(G) ; also sheet 1
PWM_RX: IC2.1(B:OUT) R28.1 ; also sheet 1
V_J1850: R10.2 R44.2 T9.2(S) U9.2(OUT) U9.4(OUT)
VPW_RX: IC2.2(A:OUT) R27.1 ; also sheet 1

## Sheet 8 of 9: BM71BLES1FC2 module
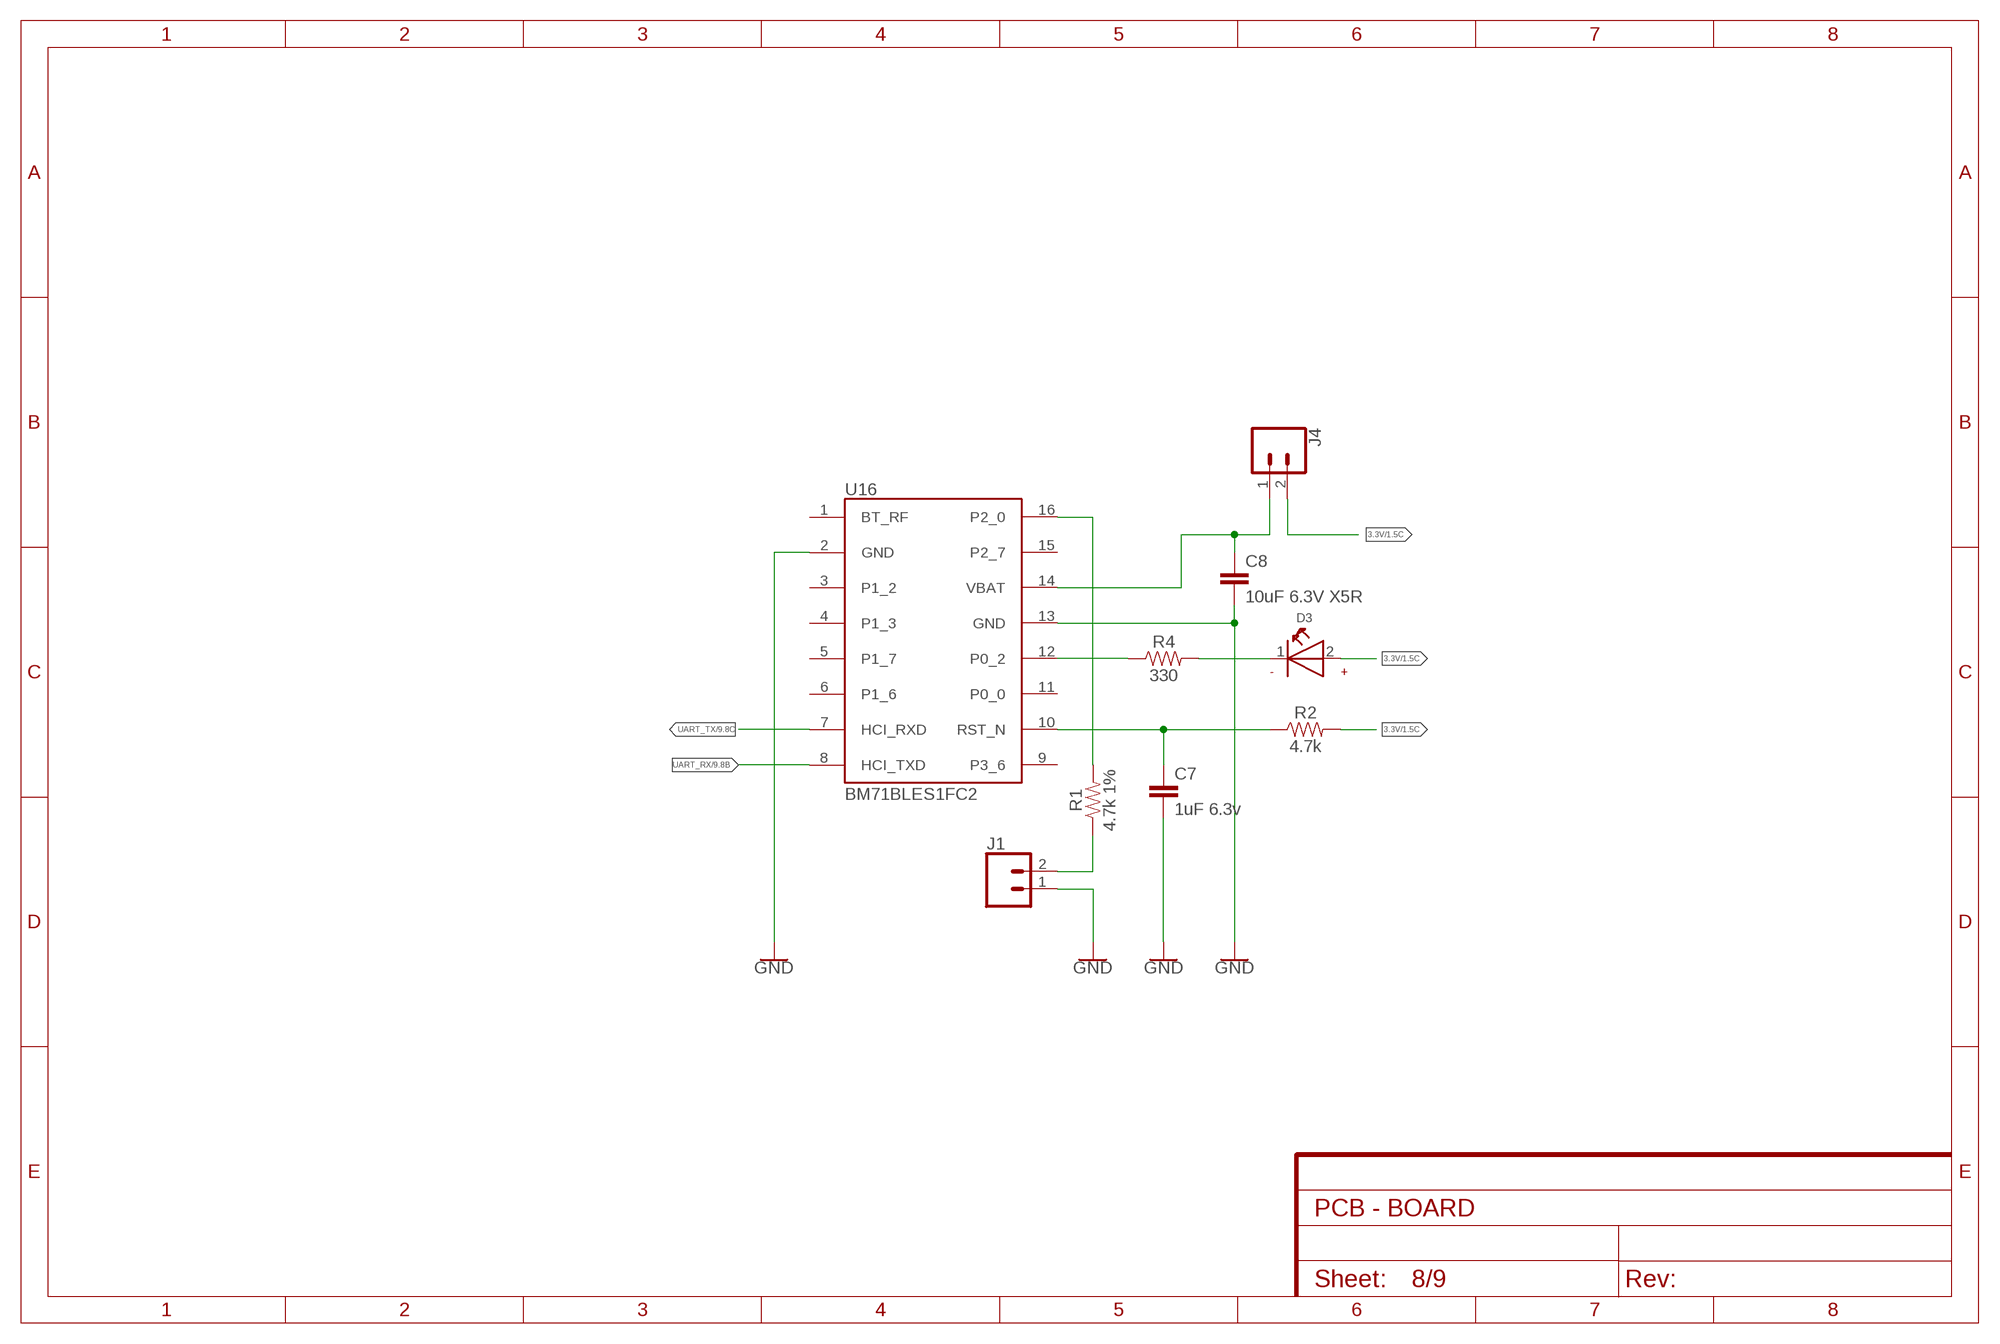
[diagram p7: schematic, sheet 8]

### Parts
C7  1uF 6.3v  1.0UF-0805-25V-(+80/-20%)  [0805]
C8  10uF 6.3V X5R  1.0UF-0805-25V-(+80/-20%)  [0805]
D3  WL-SMCW-150120BS75000-B  [WL-SMCW_1206]
J1  CONN_02  [1X02]
J4  CONN_02  [1X02]
R1  4.7k 1%  0.3OHM-0805-1/8W-1%  [0805]
R2  4.7k  0.3OHM-0805-1/8W-1%  [0805]
R4  330  0.3OHM-0805-1/8W-1%  [0805]
U16  BM71BLES1FC2  [RN4871]

### Nets
3.3V: C8.1 D3.2(+) J4.1 J4.2 R2.2 U16.14(VBAT) ; also sheet 1,2,4,5,6,7
GND: C7.2 C8.2 J1.1 U16.2(GND) U16.13(GND) ; also sheet 1,2,3,4,5,6,7,9
LED: R4.1 U16.12(P0_2)
N$2: J1.2 R1.1
N$6: D3.1(-) R4.2
N$39: C7.1 R2.1 U16.10(RST_N)
N$42: R1.2 U16.16(P2_0)
UART_RX: U16.8(HCI_TXD) ; also sheet 1,9
UART_TX: U16.7(HCI_RXD) ; also sheet 1,9
Unconnected: U16.1(BT_RF) U16.3(P1_2) U16.4(P1_3) U16.5(P1_7) U16.6(P1_6) U16.9(P3_6) U16.11(P0_0) U16.15(P2_7)

## Sheet 9 of 9: CP2102N USB to UART bridge
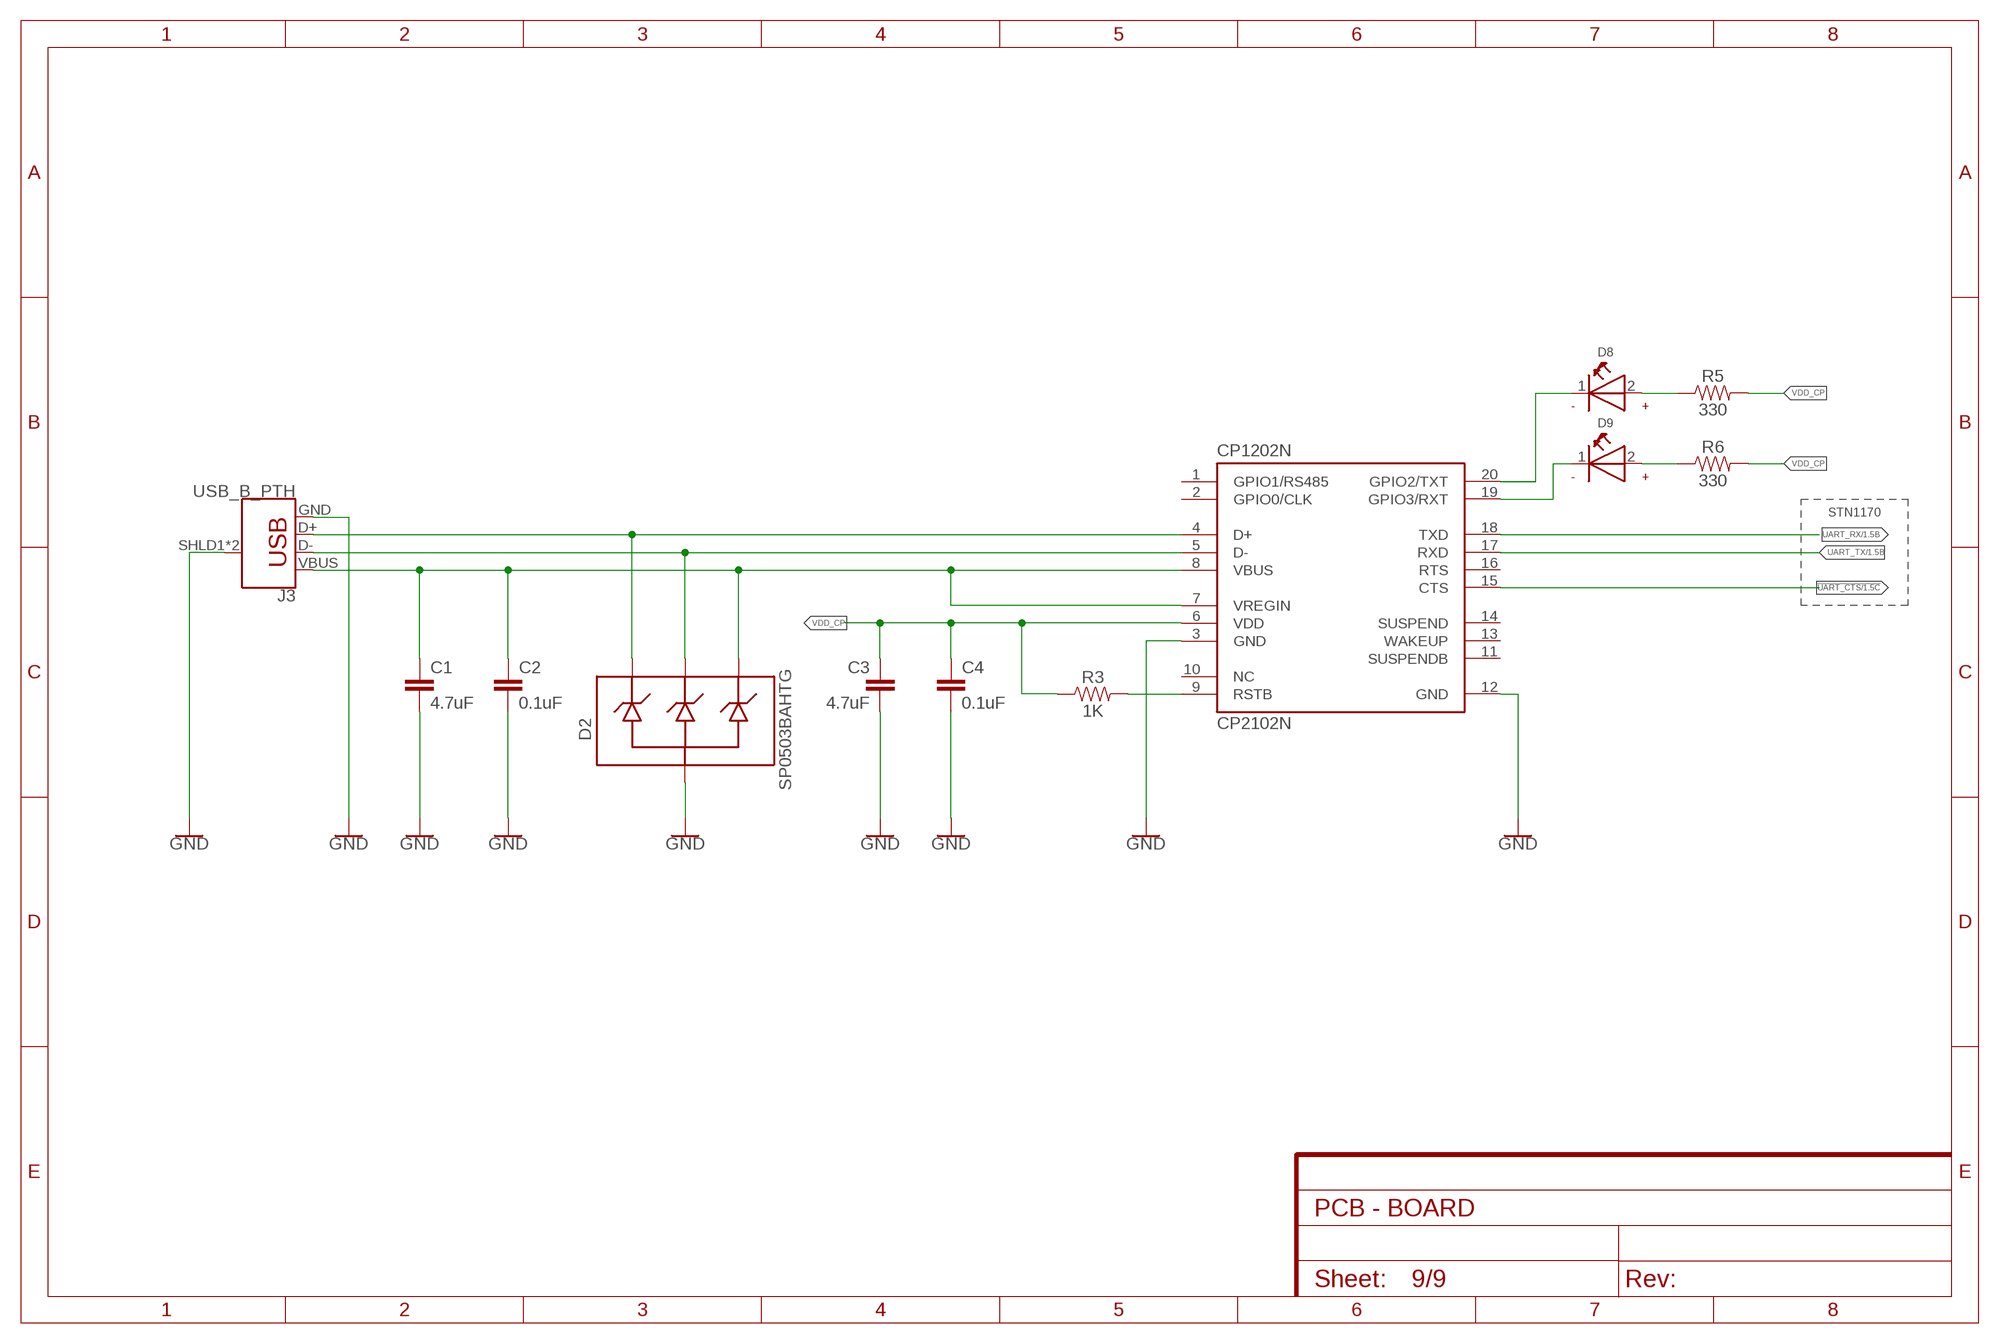
[diagram p8: schematic, sheet 9]

### Parts
C1  4.7uF  1.0UF-0805-25V-(+80/-20%)  [0805]
C2  0.1uF  1.0UF-0805-25V-(+80/-20%)  [0805]
C3  4.7uF  1.0UF-0805-25V-(+80/-20%)  [0805]
C4  0.1uF  1.0UF-0805-25V-(+80/-20%)  [0805]
CP1202N  CP2102N  [QFN20]
D2  SP0503BAHTG  [SOT143-4]
D8  WL-SMCW-150120BS75000-B  [WL-SMCW_1206]
D9  WL-SMCW-150120BS75000-B  [WL-SMCW_1206]
J3  USB_B_PTH  [USB-B-PTH]
R3  1K  0.3OHM-0805-1/8W-1%  [0805]
R5  330  0.3OHM-0805-1/8W-1%  [0805]
R6  330  0.3OHM-0805-1/8W-1%  [0805]

### Nets
!UART_CTS: CP1202N.15(CTS) ; also sheet 1
D+: CP1202N.4(D+) D2.4 J3.D+
D-: CP1202N.5(D-) D2.3 J3.D-
GND: C1.2 C2.2 C3.2 C4.2 CP1202N.3(GND) CP1202N.12(GND) D2.1 J3.GND J3.SHLD1(SHIELD) J3.SHLD2(SHIELD) ; also sheet 1,2,3,4,5,6,7,8
N$3: CP1202N.20(GPIO2/TXT) D8.1(-)
N$45: CP1202N.9(RSTB) R3.2
N$46: CP1202N.19(GPIO3/RXT) D9.1(-)
N$47: D8.2(+) R5.1
N$49: D9.2(+) R6.1
UART_RX: CP1202N.18(TXD) ; also sheet 1,8
UART_TX: CP1202N.17(RXD) ; also sheet 1,8
VBUS: C1.1 C2.1 CP1202N.7(VREGIN) CP1202N.8(VBUS) D2.2 J3.VBUS
VDD_CP: C3.1 C4.1 CP1202N.6(VDD) R3.1 R5.2 R6.2
Unconnected: CP1202N.1(GPIO1/RS485) CP1202N.2(GPIO0/CLK) CP1202N.10(NC) CP1202N.11(SUSPENDB) CP1202N.13(WAKEUP) CP1202N.14(SUSPEND) CP1202N.16(RTS)

### Notes on the sheet
- STN1170

## Library data of the parts
C1-C11 C13 C16-C23 = SparkFun-Capacitors:1.0UF: 1µF ceramic capacitors A capacitor is a passive two-terminal electrical component used to store electrical energy temporarily in an electric field.; PROD_ID: CAP-11625; VALUE: 1.0uF
C12 = prywatne:EEE-1EA330WR: Panasonic Aluminum Electrolytic Capacitors (SMD Type) Series: S Type: V
CP1202N = prywatne:CP2102N: The CP2102N devices, part of the USBXpress family, are designed to quickly add USB to your applications by eliminating firmware complexity and reducing development time.
D1 = prywatne:MMBZ27: MMBZ27VCLT1G/T3G 40 Watt Peak Power Zener Transient Voltage Suppressors SOT−23 Dual Common Cathode Zeners for ESD Protection The SZ/MMBZ27VCL is recommended by theSociety of Automotive Engineers (SAE), February 2000, J2411“Single Wire Can Network for Vehicle Applications” specification as a solution for transient voltage problems.
D2 = prywatne:SP0503BAHTG
D3-D6 D8 D9 = EAGLE-COLOR_LED-rev17b:WL-SMCW: SMD mono-color Chip LED Characteristics Low energy consumption High reliability Low current requirement Fast switching No UV/IR radiation Smallest SMD package with exceptional brightness Top view Wide viewing angle PBC high-usage Applications Backlight for mobile and portable device keypads Indoor and outdoor message boards Flat backlight for LCDs, switches and symbols Display for industrial control systems and traffic Miniaturized color effects Pedestrian mark Optical indicators General lighting Toys <http://katalog.we-online.de/media/images/eipal/WL-SMCW_pf2.jpg> Details see: http://katalog.we-online.de/en/led/WL-SMCW?m Updated 2015-04-10 2015 (C) Wurth Elektronik
D7 D22 D24-D26 D28 D31 = prywatne:BAT54XV2
D18 D19 = SparkFun-DiscreteSemi:PESD1CAN: CAN bus ESD protection diode PESD1CAN is used to protect two CAN bus lines from ESD. Link to datasheet <http://www.nxp.com/documents/data_sheet/PESD1CAN-U.pdf> SparkFun Products: SparkFun CAN-BUS Shield <https://www.sparkfun.com/products/13262>; PROD_ID: DIO-12501
D30 = s2x_10:S2*: S2A - S2M General Purpose Rectifiers Source: http://www.fairchildsemi.com/datasheets/S2/S2A.pdf; MF: Fairchild; MPN: S2A; OC_FARNELL: 1467485; OC_NEWARK: 58K2391
D32 = smaj_10:SMAJ*CA: SMAJ Series TVS Diodes Source: http://www.littelfuse.com/~/media/electronics/datasheets/tvs_diodes/littelfuse_tvs_diode_smaj_datasheet.pdf.pdf; MF: Littelfuse; MPN: SMAJ15CA; OC_FARNELL: 1827670; OC_NEWARK: 71J1959
F5 = SparkFun-Fuses:PPTC: Resettable Fuse PPTC Resettable Fuse. Really a sort of resistor with a polymeric positive temperature coefficient whose resistance increases dramatically with an increase in temperature. When heated by the power passing through the resistance rises causing the current to be limited, protecting the circuit. This is achieved by the transition of the polymer from a crystalline to an amorphous state where the conductive carbon separates breaking the conductive pathways found in the cool crystalline structure. When a PPTC cools back down it resumes conducting letting the circuit turn back on. SparkFun Products: SparkFun RedBoard - Programmed with Arduino <https://www.sparkfun.com/products/12757> Pro Micro - 5V/16MHz <https://www.sparkfun.com/products/12640> Arduino Pro 328 - 5V/16MHz <https://www.sparkfun.com/products/10915> MP3 Trigger <https://www.sparkfun.com/products/13720>; PROD_ID: RES-11150; VALUE: 6V/0.75A
IC2 = linear:LM339: Low Power Low Offset Voltage Quad Comparators with open collector; LM139/LM239/LM339/LM2901/LM3302
J1 J4 = SparkFun-Connectors:CONN_02: Multi connection point. Often used as Generic Header-pin footprint for 0.1 inch spaced/style header connections On any of the 0.1 inch spaced packages, you can populate with these: Break Away Headers - Straight <https://www.sparkfun.com/products/116> (PRT-00116) Break Away Male Headers - Right Angle <https://www.sparkfun.com/products/553> (PRT-00553) Female Headers <https://www.sparkfun.com/products/115> (PRT-00115) Break Away Headers - Machine Pin <https://www.sparkfun.com/products/117> (PRT-00117) Break Away Female Headers - Swiss Machine Pin <https://www.sparkfun.com/products/743> (PRT-00743) For SCREWTERMINALS and SPRING TERMINALS visit here: Screw Terimnals on SparkFun.com <https://www.sparkfun.com/search/results?term=Screw+Terminals> (5mm/3.5mm/2.54mm spacing) This device is also useful as a general connection point to wire up your design to another part of your project. Our various solder wires solder well into these plated through hole pads. Hook-Up Wire - Assortment (Stranded, 22 AWG) <https://www.sparkfun.com/products/11375> (PRT-11375) Hook-Up Wire - Assortment (Solid Core, 22 AWG) <https://www.sparkfun.com/products/11367> (PRT-11367) View the entire wire category on our website here <https://www.sparkfun.com/categories/141> Special notes: Molex polarized connector foot print use with: PRT-08233 with associated crimp pins and housings. 2.54_SCREWTERM for use with PRT-10571. 3.5mm Screw Terminal footprints for PRT-08084 5mm Screw Terminal footprints for use with PRT-08432
J2 = SparkFun-Connectors:CONN_11: Multi connection point. Often used as Generic Header-pin footprint for 0.1 inch spaced/style header connections On any of the 0.1 inch spaced packages, you can populate with these: Break Away Headers - Straight <https://www.sparkfun.com/products/116> (PRT-00116) Break Away Male Headers - Right Angle <https://www.sparkfun.com/products/553> (PRT-00553) Female Headers <https://www.sparkfun.com/products/115> (PRT-00115) Break Away Headers - Machine Pin <https://www.sparkfun.com/products/117> (PRT-00117) Break Away Female Headers - Swiss Machine Pin <https://www.sparkfun.com/products/743> (PRT-00743) For SCREWTERMINALS and SPRING TERMINALS visit here: Screw Terimnals on SparkFun.com <https://www.sparkfun.com/search/results?term=Screw+Terminals> (5mm/3.5mm/2.54mm spacing) This device is also useful as a general connection point to wire up your design to another part of your project. Our various solder wires solder well into these plated through hole pads. Hook-Up Wire - Assortment (Stranded, 22 AWG) <https://www.sparkfun.com/products/11375> (PRT-11375) Hook-Up Wire - Assortment (Solid Core, 22 AWG) <https://www.sparkfun.com/products/11367> (PRT-11367) View the entire wire category on our website here <https://www.sparkfun.com/categories/141>
J3 = SparkFun-Connectors:USB_B: USB Type B Connector SparkFun Products: SparkFun Stepoko <https://www.sparkfun.com/products/13899> PTH; PROD_ID: CONN-08278; SF_ID: PRT-00139
J5 J6 = SparkFun-Connectors:CONN_14: Multi connection point. Often used as Generic Header-pin footprint for 0.1 inch spaced/style header connections On any of the 0.1 inch spaced packages, you can populate with these: Break Away Headers - Straight <https://www.sparkfun.com/products/116> (PRT-00116) Break Away Male Headers - Right Angle <https://www.sparkfun.com/products/553> (PRT-00553) Female Headers <https://www.sparkfun.com/products/115> (PRT-00115) Break Away Headers - Machine Pin <https://www.sparkfun.com/products/117> (PRT-00117) Break Away Female Headers - Swiss Machine Pin <https://www.sparkfun.com/products/743> (PRT-00743) For SCREWTERMINALS and SPRING TERMINALS visit here: Screw Terimnals on SparkFun.com <https://www.sparkfun.com/search/results?term=Screw+Terminals> (5mm/3.5mm/2.54mm spacing) This device is also useful as a general connection point to wire up your design to another part of your project. Our various solder wires solder well into these plated through hole pads. Hook-Up Wire - Assortment (Stranded, 22 AWG) <https://www.sparkfun.com/products/11375> (PRT-11375) Hook-Up Wire - Assortment (Solid Core, 22 AWG) <https://www.sparkfun.com/products/11367> (PRT-11367) View the entire wire category on our website here <https://www.sparkfun.com/categories/141> Special notes: Molex polarized connector foot print use with SKU : PRT-08231 with associated crimp pins and housings. 1MM SMD Version SKU: PRT-10208 NOTES ON THE VARIANTS LOCK and LOCK_LONGPADS... This footprint was designed to help hold the alignment of a through-hole component (i.e. 6-pin header) while soldering it into place. You may notice that each hole has been shifted either up or down by 0.005 of an inch from it's more standard position (which is a perfectly straight line). This slight alteration caused the pins (the squares in the middle) to touch the edges of the holes. Because they are alternating, it causes a "brace" to hold the component in place. 0.005 has proven to be the perfect amount of "off-center" position when using our standard breakaway headers. Although looks a little odd when you look at the bare footprint, once you have a header in there, the alteration is very hard to notice. Also,if you push a header all the way into place, it is covered up entirely on the bottom side.
R1-R12 R14-R32 R35-R39 R41-R46 = SparkFun-Resistors:0.3OHM: 0.3Ω resistor A resistor is a passive two-terminal electrical component that implements electrical resistance as a circuit element. Resistors act to reduce current flow, and, at the same time, act to lower voltage levels within circuits. - Wikipedia; PROD_ID: RES-11622; VALUE: 0.3
R13 = prywatne:3521130RFT: TE CONNECTIVITY (TE) SMD POWER RESISTOR: 3521 130R 1% 2W
R33 R34 = SparkFun-Resistors:0.1OHM: 0.1Ω resistor A resistor is a passive two-terminal electrical component that implements electrical resistance as a circuit element. Resistors act to reduce current flow, and, at the same time, act to lower voltage levels within circuits. - Wikipedia; PROD_ID: RES-12374; VALUE: 0.1
R40 = SparkFun-Resistors:10OHM: 10Ω resistor A resistor is a passive two-terminal electrical component that implements electrical resistance as a circuit element. Resistors act to reduce current flow, and, at the same time, act to lower voltage levels within circuits. - Wikipedia; PROD_ID: RES-08705; VALUE: 10
T1-T3 T6 = nxp_60:2N7002: N-channel TrenchMOS FET N-channel enhancement mode Field-Effect Transistor (FET) in a plastic package using TrenchMOS technology. AAL Eindhoven MK
T7 T8 = transistor (2):*-NPN-: NPN Transistror BF959 corrected 2008.03.06
T9 = nxp_60:BSS84A: 50 V, 150 mA P-channel Trench MOSFET P-channel enhancement mode Field-Effect Transistor (FET) in a small Surface-Mounted Device (SMD) plastic package using Trench MOSFET technology. AAL Eindhoven MK
U1 = prywatne:TJA1048T: The TJA1048 is a dual high-speed CAN transceiver that provides an interface between a Controller Area Network (CAN) protocol controller and the physical two-wire CAN bus.
U9 = SparkFun-IC-Power:V_REG_317: Voltage Regulator Standard LM317 adjustable voltage regulator. AOI (Adjust Output Input). Google 'LM317 Calculator' for easy to use app to get the two resistor values needed. 240/720 for 5V output. 240/390 for 3.3V output. Spark Fun Electronics SKU : COM-00527
U10 = prywatne:TH8056-KDC-A8: The Melexis TH8056 is a physical layer device for a single wire data link capable of operating with various CSMA/CR protocols such as the Bosch Controller Area Network (CAN) version 2.0. The TH8056 transceiver is designed in accordance with the Single Wire CAN Physical Layer Specification GMW3089 V2.3 and supports many additional features like under-voltage lock-out, time-out for faulty blocked input signals, output blanking time in case of bus ringing and a very low sleep mode current.
U15 = Goodies:NCP1117: NCP1117 Avaiable in DPAK (TO-252) and SOT223 package 1.0 A Low-Dropout Positive Fixed and Adjustable Voltage Regulators
U16 = prywatne:BM71BLES1FC2: The BM71BLES1FC2 module, based on Microchip's IS187x Bluetooth LE ICs, provide a complete solution to implement Bluetooth 4.2 Low Energy connectivity.
U19 = Goodies:ZLODO1117: ZLODO1117 Avaiable in DPAK (TO-252) and SOT-223 package ZLDO1117 is a low dropout positive adjustable or fixed-mode regulator with 1A output current capability. The ZLDO1117 has a 2% tolerance across the industrial temperature range and is guaranteed to have lower than 1.2V dropout at full load current making it ideal to provide well-regulated outputs of 1.2V to 5.0V with input supply voltages up to 18V. The ZLDO1117 is ideally suited to provide well-regulated supplies for low voltage IC applications such as high-speed bus termination and low current 3.3V logic supply across the whole industrial temperature range.